# EAGLE design Matrix (EAGLE 5.06)
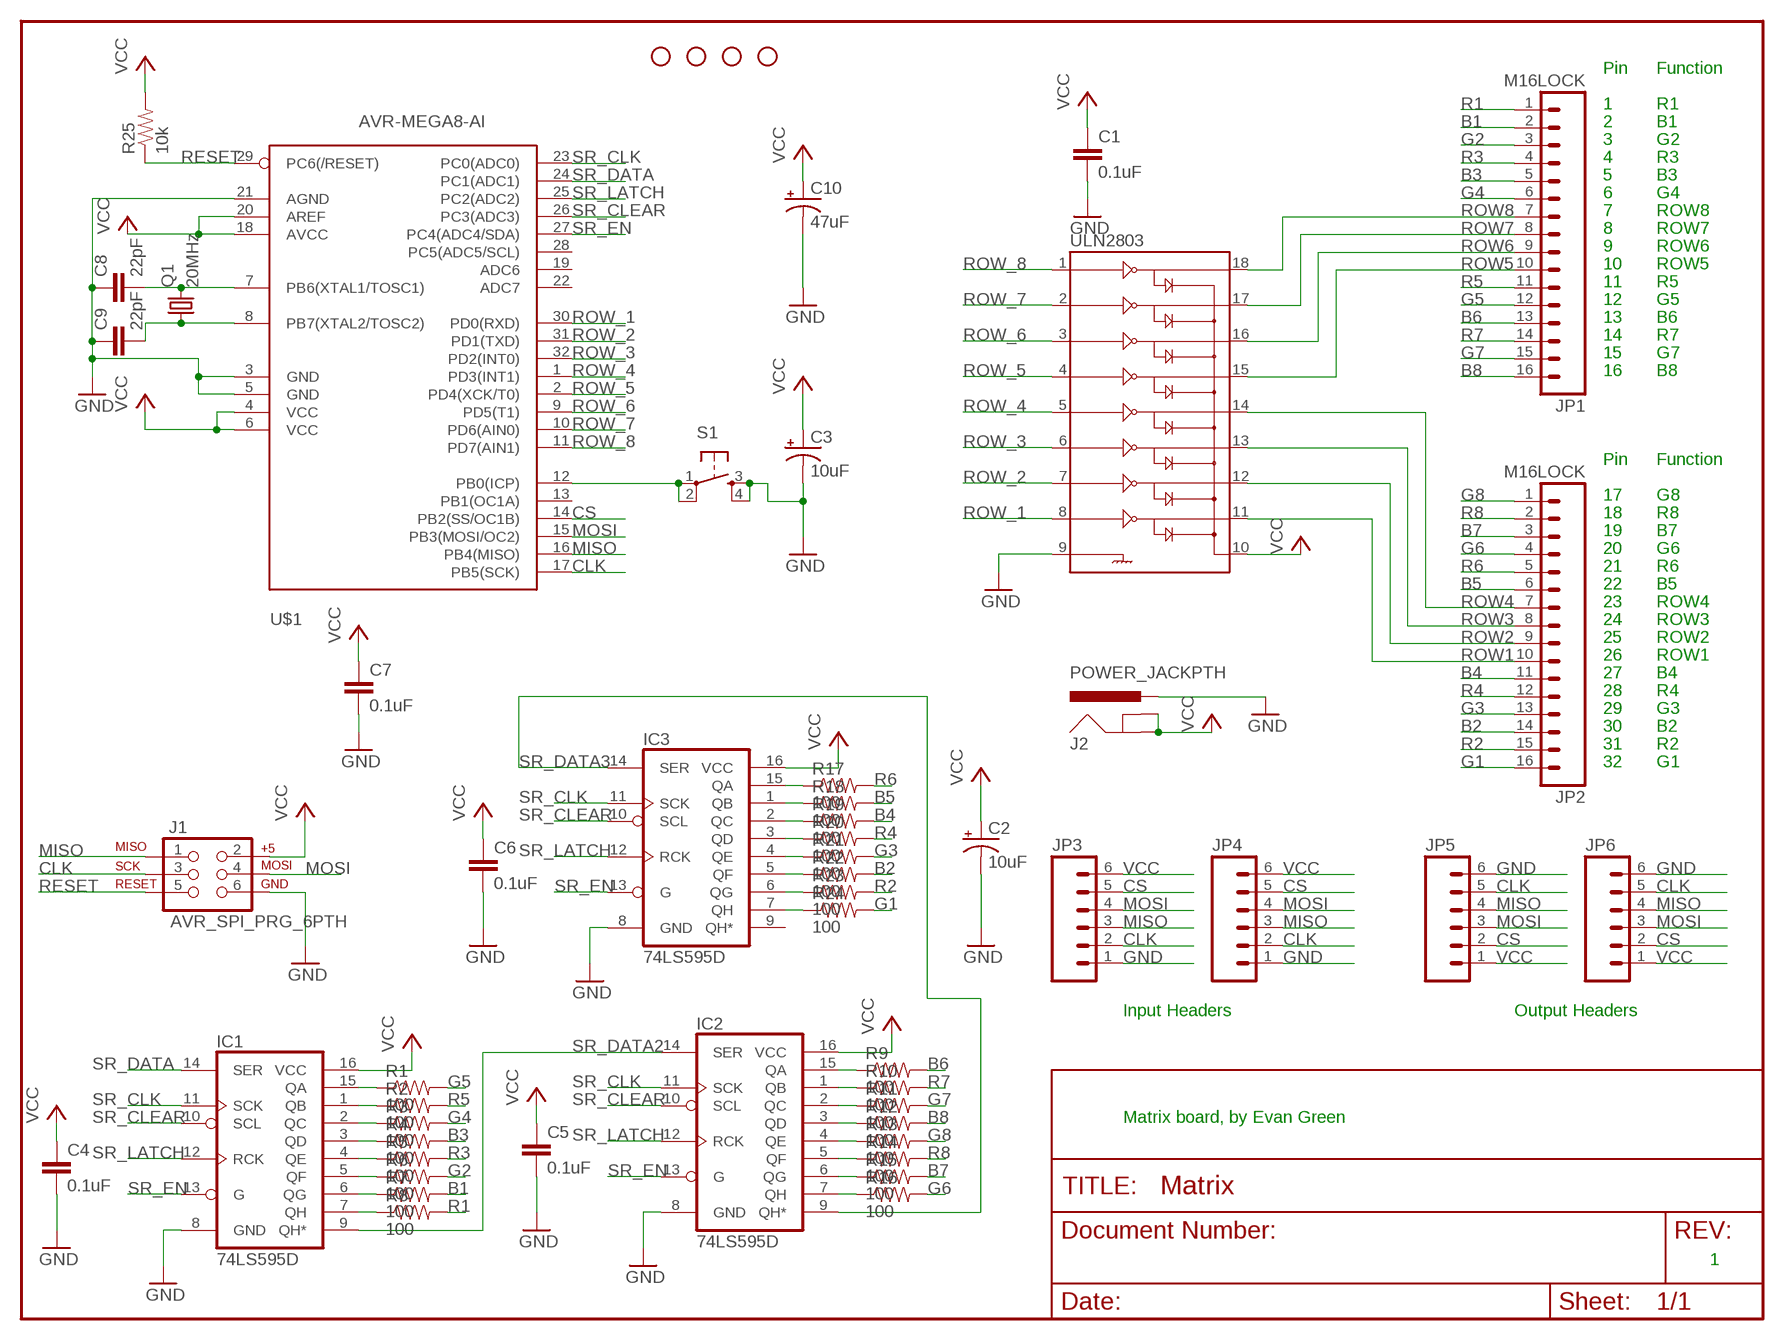
[diagram p0: schematic, sheet 1]

## Parts
C1  0.1uF  CAP0402-CAP  [0402-CAP]
C2  10uF  CAP_POLPTH2  [CPOL-RADIAL-10UF-25V]
C3  10uF  CAP_POLPTH2  [CPOL-RADIAL-10UF-25V]
C4  0.1uF  CAP0402-CAP  [0402-CAP]
C5  0.1uF  CAP0402-CAP  [0402-CAP]
C6  0.1uF  CAP0402-CAP  [0402-CAP]
C7  0.1uF  CAP0402-CAP  [0402-CAP]
C8  22pF  CAP0402-CAP  [0402-CAP]
C9  22pF  CAP0402-CAP  [0402-CAP]
C10  47uF  CAP_POLPTH2  [CPOL-RADIAL-10UF-25V]
IC1  74LS595D  [SO16]
IC2  74LS595D  [SO16]
IC3  74LS595D  [SO16]
J1  AVR_SPI_PRG_6PTH  [2X3]
J2  POWER_JACKPTH  [POWER_JACK_PTH]
JP1  M16LOCK  [1X16_LOCK]
JP2  M16LOCK  [1X16_LOCK]
JP3  M06SIP  [1X06]
JP4  M06SIP  [1X06]
JP5  M06SIP  [1X06]
JP6  M06SIP  [1X06]
JP7  STAND-OFF  [STAND-OFF]
JP8  STAND-OFF  [STAND-OFF]
JP9  STAND-OFF  [STAND-OFF]
JP10  STAND-OFF  [STAND-OFF]
Q1  20MHz  CRYSTALHC49US  [HC49US]
R1  100  RESISTOR0402-RES  [0402-RES]
R2  100  RESISTOR0402-RES  [0402-RES]
R3  100  RESISTOR0402-RES  [0402-RES]
R4  100  RESISTOR0402-RES  [0402-RES]
R5  100  RESISTOR0402-RES  [0402-RES]
R6  100  RESISTOR0402-RES  [0402-RES]
R7  100  RESISTOR0402-RES  [0402-RES]
R8  100  RESISTOR0402-RES  [0402-RES]
R9  100  RESISTOR0402-RES  [0402-RES]
R10  100  RESISTOR0402-RES  [0402-RES]
R11  100  RESISTOR0402-RES  [0402-RES]
R12  100  RESISTOR0402-RES  [0402-RES]
R13  100  RESISTOR0402-RES  [0402-RES]
R14  100  RESISTOR0402-RES  [0402-RES]
R15  100  RESISTOR0402-RES  [0402-RES]
R16  100  RESISTOR0402-RES  [0402-RES]
R17  100  RESISTOR0402-RES  [0402-RES]
R18  100  RESISTOR0402-RES  [0402-RES]
R19  100  RESISTOR0402-RES  [0402-RES]
R20  100  RESISTOR0402-RES  [0402-RES]
R21  100  RESISTOR0402-RES  [0402-RES]
R22  100  RESISTOR0402-RES  [0402-RES]
R23  100  RESISTOR0402-RES  [0402-RES]
R24  100  RESISTOR0402-RES  [0402-RES]
R25  10k  RESISTOR0402-RES  [0402-RES]
S1  TAC_SWITCHSMD  [TACTILE_SWITCH_SMD]
U$1  AVR-MEGA8-AI  [TQFP32-08]
ULN2803  ULN2803SOICW  [SO18L]

## Nets
B1: JP1.2 R7.2
B2: JP2.14 R22.2
B3: JP1.5 R4.2
B4: JP2.11 R19.2
B5: JP2.6 R18.2
B6: JP1.13 R9.2
B7: JP2.3 R15.2
B8: JP1.16 R12.2
CLK: J1.3 JP3.2 JP4.2 JP5.5 JP6.5 U$1.17(PB5(SCK))
CS: JP3.5 JP4.5 JP5.2 JP6.2 U$1.14(PB2(SS/OC1B))
G1: JP2.16 R24.2
G2: JP1.3 R6.2
G3: JP2.13 R21.2
G4: JP1.6 R3.2
G5: JP1.12 R1.2
G6: JP2.4 R16.2
G7: JP1.15 R11.2
G8: JP2.1 R13.2
GND: C1.2 C2.2(-) C3.2(-) C4.2 C5.2 C6.2 C7.2 C8.1 C9.1 C10.2(-) IC1.8(GND) IC2.8(GND) IC3.8(GND) J1.6 J2.PWR JP3.1 JP4.1 JP5.6 JP6.6 S1.3 S1.4 U$1.3(GND) U$1.5(GND) U$1.21(AGND) ULN2803.9
MISO: J1.1 JP3.3 JP4.3 JP5.4 JP6.4 U$1.16(PB4(MISO))
MOSI: J1.4 JP3.4 JP4.4 JP5.3 JP6.3 U$1.15(PB3(MOSI/OC2))
N$1: IC1.15(QA) R1.1
N$2: IC1.1(QB) R2.1
N$3: IC1.2(QC) R3.1
N$4: IC1.3(QD) R4.1
N$5: IC1.4(QE) R5.1
N$6: IC1.5(QF) R6.1
N$7: IC1.6(QG) R7.1
N$8: IC1.7(QH) R8.1
N$9: IC2.15(QA) R9.1
N$10: IC2.1(QB) R10.1
N$11: IC2.2(QC) R11.1
N$12: IC2.3(QD) R12.1
N$13: IC2.4(QE) R13.1
N$14: IC2.5(QF) R14.1
N$15: IC2.6(QG) R15.1
N$16: IC2.7(QH) R16.1
N$17: IC3.15(QA) R17.1
N$18: IC3.1(QB) R18.1
N$19: IC3.2(QC) R19.1
N$20: IC3.3(QD) R20.1
N$21: IC3.4(QE) R21.1
N$22: IC3.5(QF) R22.1
N$23: IC3.6(QG) R23.1
N$24: IC3.7(QH) R24.1
N$25: C8.2 Q1.2 U$1.7(PB6(XTAL1/TOSC1))
N$26: C9.2 Q1.1 U$1.8(PB7(XTAL2/TOSC2))
N$27: S1.1 S1.2 U$1.12(PB0(ICP))
R1: JP1.1 R8.2
R2: JP2.15 R23.2
R3: JP1.4 R5.2
R4: JP2.12 R20.2
R5: JP1.11 R2.2
R6: JP2.5 R17.2
R7: JP1.14 R10.2
R8: JP2.2 R14.2
RESET: J1.5 R25.1 U$1.29(PC6(/RESET))
ROW1: JP2.10 ULN2803.11
ROW2: JP2.9 ULN2803.12
ROW3: JP2.8 ULN2803.13
ROW4: JP2.7 ULN2803.14
ROW5: JP1.10 ULN2803.15
ROW6: JP1.9 ULN2803.16
ROW7: JP1.8 ULN2803.17
ROW8: JP1.7 ULN2803.18
ROW_1: U$1.30(PD0(RXD)) ULN2803.8
ROW_2: U$1.31(PD1(TXD)) ULN2803.7
ROW_3: U$1.32(PD2(INT0)) ULN2803.6
ROW_4: U$1.1(PD3(INT1)) ULN2803.5
ROW_5: U$1.2(PD4(XCK/T0)) ULN2803.4
ROW_6: U$1.9(PD5(T1)) ULN2803.3
ROW_7: U$1.10(PD6(AIN0)) ULN2803.2
ROW_8: U$1.11(PD7(AIN1)) ULN2803.1
SR_CLEAR: IC1.10(SCL) IC2.10(SCL) IC3.10(SCL) U$1.26(PC3(ADC3))
SR_CLK: IC1.11(SCK) IC2.11(SCK) IC3.11(SCK) U$1.23(PC0(ADC0))
SR_DATA: IC1.14(SER) U$1.24(PC1(ADC1))
SR_DATA2: IC1.9(QH*) IC2.14(SER)
SR_DATA3: IC2.9(QH*) IC3.14(SER)
SR_EN: IC1.13(G) IC2.13(G) IC3.13(G) U$1.27(PC4(ADC4/SDA))
SR_LATCH: IC1.12(RCK) IC2.12(RCK) IC3.12(RCK) U$1.25(PC2(ADC2))
VCC: C1.1 C2.1(+) C3.1(+) C4.1 C5.1 C6.1 C7.1 C10.1(+) IC1.16(VCC) IC2.16(VCC) IC3.16(VCC) J1.2 J2.GND J2.GNDBREAK JP3.6 JP4.6 JP5.1 JP6.1 R25.2 U$1.4(VCC) U$1.6(VCC) U$1.18(AVCC) U$1.20(AREF) ULN2803.10
Unconnected: IC3.9(QH*) U$1.13(PB1(OC1A)) U$1.19(ADC6) U$1.22(ADC7) U$1.28(PC5(ADC5/SCL))

## Notes on the sheet
- Pin | Function
- 1 | R1
- 2 | B1
- 3 | G2
- 4 | R3
- 5 | B3
- 6 | G4
- 7 | ROW8
- 8 | ROW7
- 9 | ROW6
- 10 | ROW5
- 11 | R5
- 12 | G5
- 13 | B6
- 14 | R7
- 15 | G7
- 16 | B8
- Pin | Function
- 17 | G8
- 18 | R8
- 19 | B7
- 20 | G6
- 21 | R6
- 22 | B5
- 23 | ROW4
- 24 | ROW3
- 25 | ROW2
- 26 | ROW1
- 27 | B4
- 28 | R4
- 29 | G3
- 30 | B2
- 31 | R2
- 32 | G1
- Input Headers | Output Headers
- Matrix board, by Evan Green
- 1

## Library data of the parts
C1 C4-C9 = SparkFun:CAP: Capacitor Standard 0603 ceramic capacitor, and 0.1" leaded capacitor.
C2 C3 C10 = SparkFun:CAP_POL: Capacitor Polarized These are standard SMD and PTH capacitors. Normally 10uF, 47uF, and 100uF in electrolytic and tantalum varieties. Always verify the external diameter of the through hole cap, it varies with capacity, voltage, and manufacturer. The EIA devices should be standard.
IC1-IC3 = SparkFun:74*595: 8-bit SHIFT REGISTER, output latch
J1 = SparkFun:AVR_SPI_PRG_6: AVR ISP 6 Pin This is the reduced ISP connector for AVR programming. Common on Arduino. This footprint will take up less PCB space and can be used with a 10-pin to 6-pin adapter such as SKU: BOB-08508
J2 = SparkFun:POWER_JACK: Power Jack This is the standard 5.5mm barrel jack for power. The PTH is the most common, proven, reliable, footprint. All others are experimental. The Slot footprint only works if the mill layer is transmitted to the PCB fab house so be warned. Spark Fun Electronics SKU : PRT-00119. Mating wall wart : TOL-00298 (and others)
JP1 JP2 = SparkFun:M16
JP3-JP6 = SparkFun:M06: Header 6 Standard 6-pin 0.1" header. Use with straight break away headers (SKU : PRT-00116), right angle break away headers (PRT-00553), swiss pins (PRT-00743), machine pins (PRT-00117), and female headers (PRT-00115). Molex polarized connector foot print use with SKU : PRT-08094 with associated crimp pins and housings. NOTES ON THE VARIANTS LOCK and LOCK_LONGPADS... This footprint was designed to help hold the alignment of a through-hole component (i.e. 6-pin header) while soldering it into place. You may notice that each hole has been shifted either up or down by 0.005 of an inch from it's more standard position (which is a perfectly straight line). This slight alteration caused the pins (the squares in the middle) to touch the edges of the holes. Because they are alternating, it causes a "brace" to hold the component in place. 0.005 has proven to be the perfect amount of "off-center" position when using our standard breakaway headers. Although looks a little odd when you look at the bare footprint, once you have a header in there, the alteration is very hard to notice. Also, if you push a header all the way into place, it is covered up entirely on the bottom side. This idea of altering the position of holes to aid alignment will be further integrated into the Sparkfun Library for other footprints. It can help hold any component with 3 or more connection pins.
JP7-JP10 = SparkFun:STAND-OFF: Stand Off This is the mechanical footprint for a #4 phillips button head screw. Use the keepout ring to avoid running the screw head into surrounding components. SKU : PRT-00447
Q1 = SparkFun:CRYSTAL: Crystals Various standard crystals. Proven footprints. Spark Fun Electronics SKU : COM-00534
R1-R25 = SparkFun:RESISTOR: Resistor Basic schematic elements and footprints for 0603, 1206, and PTH 1/10th watt (small) resistors.
S1 = SparkFun:TAC_SWITCH: Momentary Switch Button commonly used for reset or general input. Spark Fun Electronics SKU : COM-00097
U$1 = SparkFun:AVR-MEGA8: MICROCONTROLLER 8 Kbytes FLASH 1 kbytes SRAM 512 bytes EEPROM USART 6-channel 10 bit ADC 2-channel 8 bit ADC
ULN2803 = SparkFun:ULN2803: Darlington Driver ULN2803 Darlington array. 500mA max per channel, 8-channel package. Spark Fun Electronics SKU : COM-00312

## Board
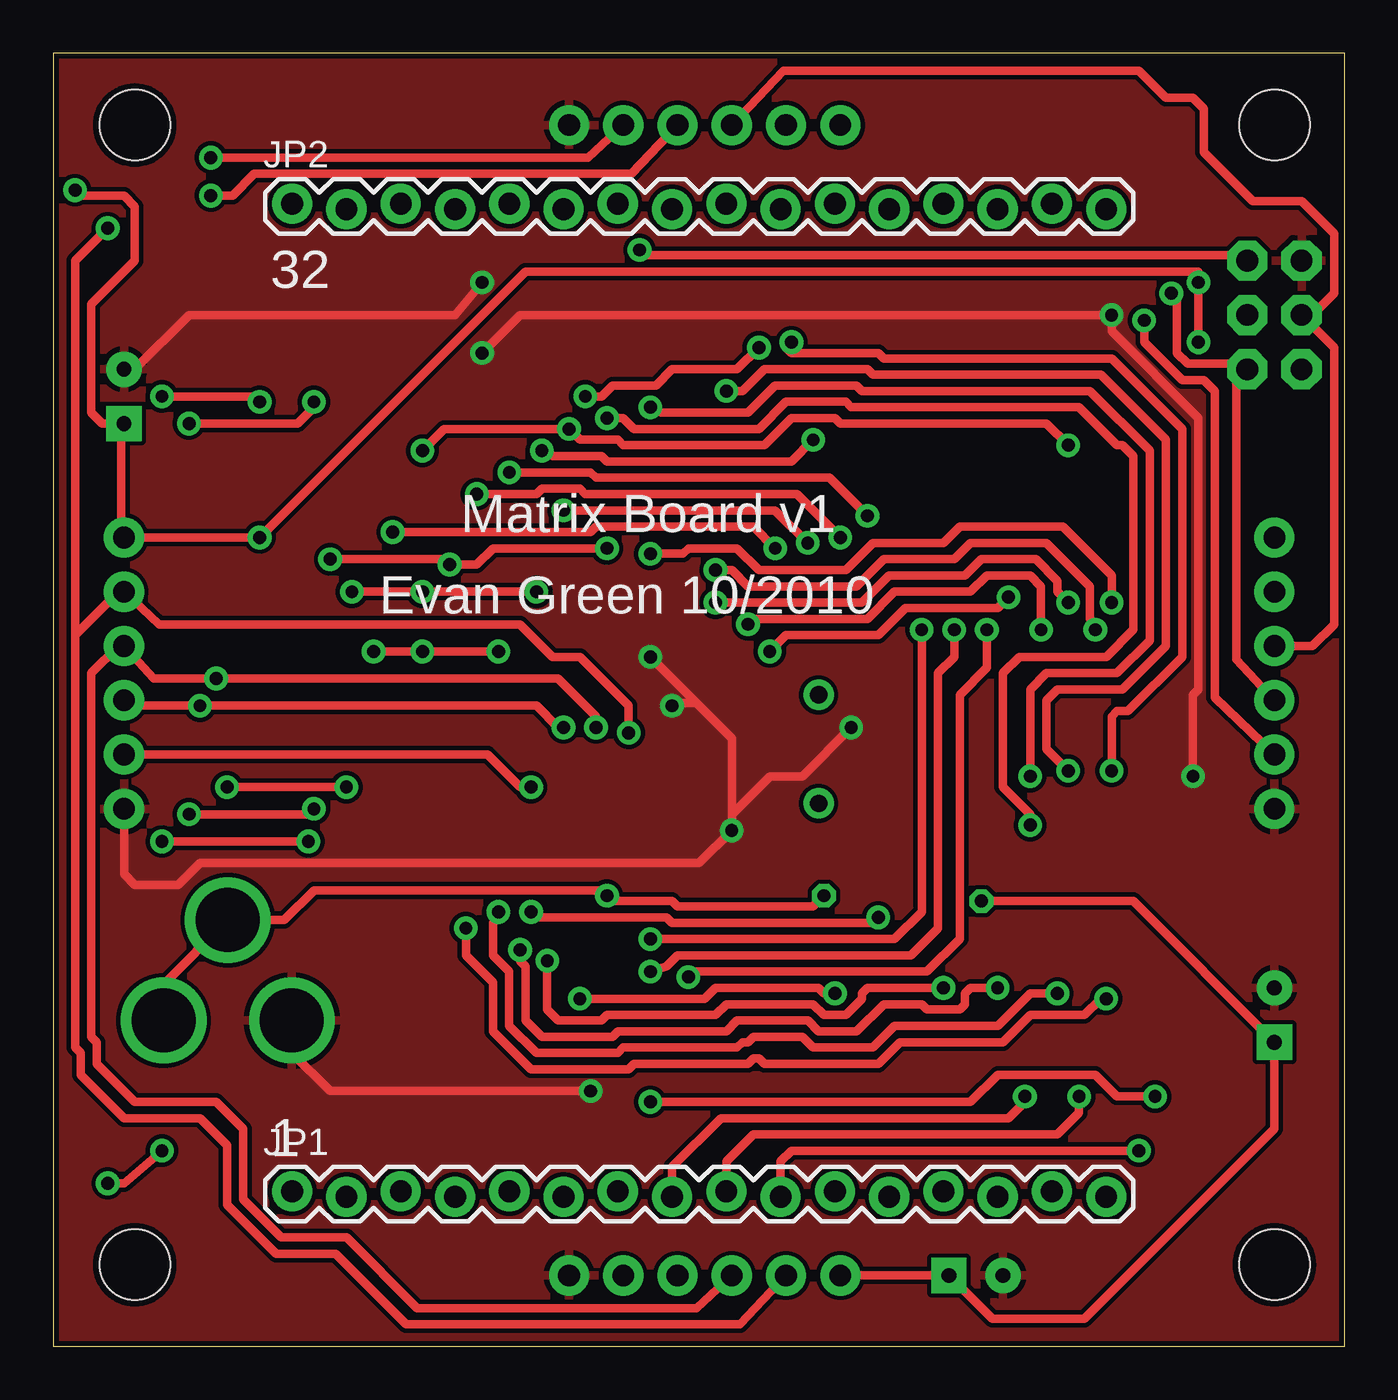
[diagram p1: board, top side]
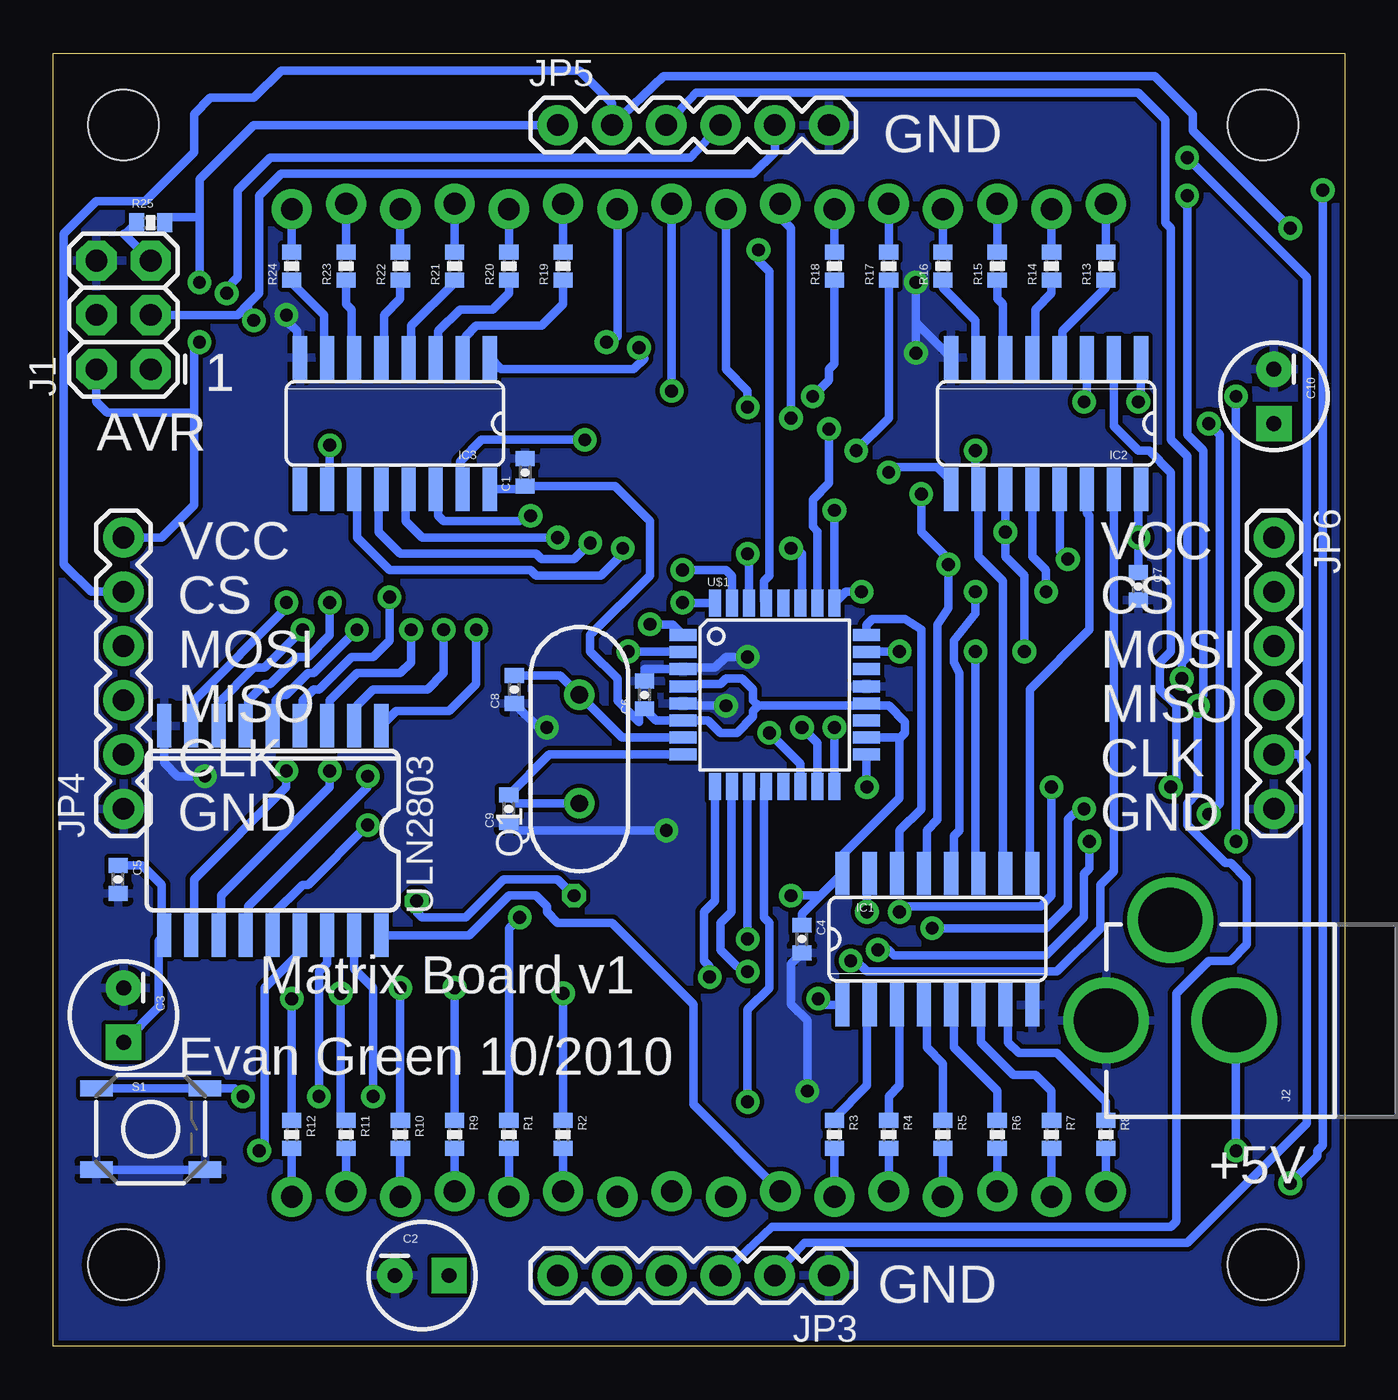
[diagram p2: board, bottom side, seen from below]

Size 60.43 x 60.5 mm. Coordinates in mm from the lower left corner, seen from the top.
Outline: 0,0 60.43,0 60.43,60.5 0,60.5 0,0
Copper layers (1*16): Top 0.035mm / dielectric 1.5mm / Bottom 0.035mm
Design rules "SparkFun": minimum track width 8mil, minimum drill 20mil, track to track 8mil, track to pad 8mil, pad to pad 8mil, via to via 8mil, smd to smd 8mil, copper to edge 10mil, drill to drill 8mil, minimum pad ring 12mil, minimum via ring 10mil, stop-mask expansion 4mil, vias tented up to drill 25mil, thermal gap 10mil

### Footprints (pad centres in the part's own frame; a part is rotated, then mirrored left to right if it is on the bottom)
0402-CAP = smd 0.7 x 0.9: 1 -0.65,0; 2 0.65,0
CPOL-RADIAL-10UF-25V = drill 0.7 pad 1.651 square: 1 1.27,0 | drill 0.7 pad 1.651 round: 2 -1.27,0
SO16 = smd 0.66 x 2.032: 1 -4.445,-3.073; 2 -3.175,-3.073; 3 -1.905,-3.073; 4 -0.635,-3.073; 5 0.635,-3.073; 6 1.905,-3.073; 7 3.175,-3.073; 8 4.445,-3.073; 9 4.445,3.073; 10 3.175,3.073; 11 1.905,3.073; 12 0.635,3.073; 13 -0.635,3.073; 14 -1.905,3.073; 15 -3.175,3.073; 16 -4.445,3.073
2X3 = drill 1.016 pad 1.88 octagon: 1 0,0; 2 0,2.54; 3 2.54,0; 4 2.54,2.54; 5 5.08,0; 6 5.08,2.54
POWER_JACK_PTH = drill 2.997 round: GND 0,7.7; GNDBREAK 4.7,10.7; PWR 0,13.7
1X16_LOCK = drill 1.016 pad 1.88 round: 1 0,0.127; 2 2.54,-0.127; 3 5.08,0.127; 4 7.62,-0.127; 5 10.16,0.127; 6 12.7,-0.127; 7 15.24,0.127; 8 17.78,-0.127; 9 20.32,0.127; 10 22.86,-0.127; 11 25.4,0.127; 12 27.94,-0.127; 13 30.48,0.127; 14 33.02,-0.127; 15 35.56,0.127; 16 38.1,-0.127
1X06 = drill 1.016 pad 1.88 round: 1 0,0; 2 2.54,0; 3 5.08,0; 4 7.62,0; 5 10.16,0; 6 12.7,0
STAND-OFF = hole 3.302: 0,0
HC49US = drill 0.813 round: 1 -2.54,0; 2 2.54,0
0402-RES = smd 0.7 x 0.9: 1 -0.65,0; 2 0.65,0
TACTILE_SWITCH_SMD = smd 1.524 x 0.762: 1 -2.54,1.905; 2 2.54,1.905; 3 -2.54,-1.905; 4 2.54,-1.905
TQFP32-08 = smd 1.27 x 0.559: 1 -4.293,2.8; 2 -4.293,2; 3 -4.293,1.2; 4 -4.293,0.4; 5 -4.293,-0.4; 6 -4.293,-1.2; 7 -4.293,-2; 8 -4.293,-2.8; 17 4.293,-2.8; 18 4.293,-2; 19 4.293,-1.2; 20 4.293,-0.4; 21 4.293,0.4; 22 4.293,1.2; 23 4.293,2; 24 4.293,2.8 | smd 0.559 x 1.27: 9 -2.8,-4.293; 10 -2,-4.293; 11 -1.2,-4.293; 12 -0.4,-4.293; 13 0.4,-4.293; 14 1.2,-4.293; 15 2,-4.293; 16 2.8,-4.293; 25 2.8,4.293; 26 2,4.293; 27 1.2,4.293; 28 0.4,4.293; 29 -0.4,4.293; 30 -1.2,4.293; 31 -2,4.293; 32 -2.8,4.293
SO18L = smd 0.66 x 2.032: 1 -0.635,-4.902; 2 0.635,-4.902; 3 1.905,-4.902; 4 3.175,-4.902; 5 4.445,-4.902; 6 5.715,-4.902; 7 6.985,-4.902; 8 8.255,-4.902; 9 9.525,-4.902; 10 9.525,4.902; 11 8.255,4.902; 12 6.985,4.902; 13 5.715,4.902; 14 4.445,4.902; 15 3.175,4.902; 16 1.905,4.902; 17 0.635,4.902; 18 -0.635,4.902

### Placement (x,y rotation side)
C1  38.35,40.89 90 bottom
C2  43.18,3.3 0 bottom
C3  57.15,15.49 270 bottom
C4  25.4,19.05 270 bottom
C5  57.4,21.84 270 bottom
C6  32.77,30.48 90 bottom
C7  9.65,35.56 270 bottom
C8  38.86,30.73 90 bottom
C9  39.12,25.15 90 bottom
C10  3.3,44.45 270 bottom
IC1  19.05,19.05 0 bottom
IC2  13.97,43.18 180 bottom
IC3  44.45,43.18 180 bottom
J1  55.88,45.72 90 bottom
J2  -2.54,15.24 90 bottom
JP1  11.18,7.11 0 top
JP2  11.18,53.34 0 top
JP3  24.13,3.3 180 bottom
JP4  57.15,25.15 90 bottom
JP5  36.83,57.15 0 bottom
JP6  3.3,37.85 270 bottom
JP7  3.81,3.81 0 top
JP8  3.81,57.15 0 top
JP9  57.15,57.15 0 top
JP10  57.15,3.81 0 top
Q1  35.81,27.94 90 bottom
R1  39.12,9.91 270 bottom
R2  36.58,9.91 270 bottom
R3  23.88,9.91 270 bottom
R4  21.34,9.91 270 bottom
R5  18.8,9.91 270 bottom
R6  16.26,9.91 270 bottom
R7  13.72,9.91 270 bottom
R8  11.18,9.91 270 bottom
R9  41.66,9.91 270 bottom
R10  44.2,9.91 270 bottom
R11  46.74,9.91 270 bottom
R12  49.28,9.91 270 bottom
R13  11.18,50.55 90 bottom
R14  13.72,50.55 90 bottom
R15  16.26,50.55 90 bottom
R16  18.8,50.55 90 bottom
R17  21.34,50.55 90 bottom
R18  23.88,50.55 90 bottom
R19  36.58,50.55 90 bottom
R20  39.12,50.55 90 bottom
R21  41.66,50.55 90 bottom
R22  44.2,50.55 90 bottom
R23  46.74,50.55 90 bottom
R24  49.28,50.55 90 bottom
R25  55.88,52.58 0 bottom
S1  55.88,10.16 0 bottom
U$1  26.67,30.48 0 bottom
ULN2803  45.72,24.13 180 bottom

### Tracks (layer width: path | path; a pad name or v marks a point on that pad's centre or on a via)
B1
  Bottom 0.406: JP1.2 R7.2
B2
  Bottom 0.406: R22.2 JP2.14
B3
  Bottom 0.406: JP1.5 R4.2
B4
  Bottom 0.406: R19.2 JP2.11
B5
  Bottom 0.406: R18.2 JP2.6
B6
  Bottom 0.406: JP1.13 R9.2
B7
  Bottom 0.406: R15.2 JP2.3
B8
  Bottom 0.406: JP1.16 R12.2
CLK  (via drill 0.6)
  Top 0.406: JP6.5 20.32,27.69 21.84,26.16 v22.35,26.16 | JP5.5 25.02,55.63 v7.37,55.63 | JP4.2 54.36,30.35 54.36,44.7 53.85,45.21 52.83,45.21 51.05,46.99 v51.05,48.01
  Bottom 0.406: v22.35,26.16 22.38,26.19 U$1.17 | JP3.2 25.27,4.83 7.37,4.83 1.78,10.41 1.78,27.18 2.03,27.43 2.03,27.69 | 3.17,27.3 JP6.5 2.03,27.69 | v7.37,55.63 1.78,50.04 1.78,27.94 2.03,27.69 | JP5.5 26.67,55.88 27.69,54.86 49.78,54.86 50.8,53.85 50.8,49.28 51.31,48.77 | 51.31,48.77 51.82,48.26 J1.3 | v51.05,48.01 51.31,48.26 51.31,48.77
CS  (via drill 0.6)
  Top 0.406: v26.92,28.7 26.92,29.97 24.64,32.26 23.37,32.26 21.84,33.78 4.95,33.78 JP6.2 3.05,35.31 1.02,33.27 | JP3.5 32.13,1.02 16.51,1.02 13.21,4.32 10.41,4.32 8.13,6.6 8.13,9.4 6.86,10.67 3.3,10.67 1.27,12.7 1.27,13.72 1.02,13.97 1.02,33.27 | v2.54,52.32 1.02,50.8 1.02,33.27
  Bottom 0.406: v26.92,28.7 25.47,27.25 U$1.14 | v2.54,52.32 7.11,56.9 7.11,57.66 8.89,59.44 31.88,59.44 JP5.2 34.29,58.17 35.81,59.69 49.78,59.69 51.05,58.42 53.09,58.42 53.85,57.66 53.85,55.88 56.13,53.59 58.42,53.59 59.94,52.07 59.94,36.58 58.67,35.31 JP4.5
G1
  Bottom 0.406: R24.2 JP2.16
G2
  Bottom 0.406: JP1.3 R6.2
G3
  Bottom 0.406: R21.2 JP2.13
G4
  Bottom 0.406: JP1.6 R3.2
G5
  Bottom 0.406: JP1.12 R1.2
G6
  Bottom 0.406: R16.2 JP2.4
G7
  Bottom 0.406: JP1.15 R11.2
G8
  Bottom 0.406: R13.2 JP2.1
GND  (via drill 0.6)
  Top 0.406: v20.07,49.78 18.8,48.26 6.35,48.26 3.81,45.72 C10.2 | v25.15,11.94 12.95,11.94 11.16,13.73 J2.PWR | v31.75,24.13 30.23,22.61 6.86,22.61 5.84,21.59 3.81,21.59 3.3,22.1 JP6.6 | v37.34,28.96 35.05,26.67 33.53,26.67 31.75,24.89 v31.75,24.13 | 30.1,30.1 31.75,28.45 v31.75,24.13 | 30.1,30.1 v27.94,32.26 | v28.96,29.97 28.83,30.1 30.1,30.1 | v20.07,46.48 21.84,48.26 v49.53,48.26 49.53,47.5 53.59,43.43 53.59,30.73 53.34,30.48 v53.34,26.67
  Bottom 0.406: IC2.8 20.07,47.9 v20.07,49.78 v20.07,46.48 | C4.2 25.91,17.89 25.91,16 25.15,15.24 v25.15,11.94 | C9.1 38.75,24.13 v31.75,24.13 | C8.1 37.73,28.96 v37.34,28.96 | v27.94,32.26 28.96,32.26 29.46,31.75 30.89,31.75 U$1.3 32.77,31.68 C6.2 | U$1.5 30.86,29.97 v28.96,29.97 | IC3.8 49.02,46.38 49.02,47.5 49.53,48.01 v49.53,48.26 | v53.34,26.67 54.61,26.67 55.24,27.3 ULN2803.9 | S1.4 S1.3
  pour Top: 0,0 60.45,0 60.45,60.45 0,60.45
  pour Bottom: 0,60.45 0,0 60.45,0 60.45,60.45
MISO  (via drill 0.6)
  Top 0.406: JP6.4 3.68,29.97 v6.86,29.97 22.61,29.97 23.62,28.96 v23.88,28.96 | JP5.4 27.05,54.86 9.4,54.86 8.38,53.85 v7.37,53.85 | 55.37,45.72 J1.1 | JP4.3 55.37,32.13 55.37,45.72 | 55.37,45.72 55.12,45.97 53.09,45.97 52.58,46.48 52.58,49.02 v52.32,49.28
  Bottom 0.406: v23.88,28.96 v23.87,28.95 U$1.16 | JP3.3 26.8,5.59 8.13,5.59 7.87,5.84 7.87,16.51 6.35,18.03 5.33,18.03 4.57,18.8 4.57,21.84 5.33,22.61 5.59,22.61 7.37,24.38 7.37,25.4 6.86,25.91 v6.86,29.97 6.86,30.23 6.6,30.48 6.6,41.91 7.37,42.67 7.37,53.34 7.62,53.59 v7.37,53.85 | JP5.4 30.61,55.63 50.29,55.63 51.82,54.1 51.82,50.04 52.07,49.78 v52.32,49.28
MOSI  (via drill 0.6)
  Top 0.406: v25.4,28.96 25.4,29.46 23.62,31.24 v7.62,31.24 4.7,31.24 JP6.3 3.05,32.77 1.78,31.5 1.78,14.48 2.03,14.22 2.03,13.21 3.81,11.43 7.62,11.43 8.89,10.16 8.89,6.86 10.67,5.08 13.72,5.08 17.02,1.78 30.1,1.78 JP3.4 | JP5.3 34.16,59.69 50.8,59.69 52.07,58.42 53.34,58.42 53.85,57.91 53.85,55.88 56.13,53.59 58.42,53.59 59.94,52.07 59.94,49.28 58.93,48.26 J1.4 59.94,46.74 59.94,33.78 58.93,32.77 JP4.4
  Bottom 0.406: v25.4,28.96 24.67,28.23 U$1.15 | JP5.3 30.35,58.67 9.65,58.67 8.38,57.4 8.38,52.58 8.13,52.32 8.13,42.42 7.37,41.66 7.37,32.26 7.62,32 v7.62,31.24
N$1  (via drill 0.6)
  Top 0.406: v22.35,20.32 22.61,20.07 28.7,20.07 28.96,19.81 38.35,19.81 v38.61,20.07
  Bottom 0.406: IC1.15 22.35,22 v22.35,20.32 | v38.61,20.07 39.12,19.56 R1.1
N$2  (via drill 0.6)
  Top 0.406: v24.64,16.26 30.48,16.26 30.99,16.76 35.81,16.76 36.07,16.51 v36.58,16.51
  Bottom 0.406: v36.58,16.51 R2.1 | v24.64,16.26 24.36,15.98 IC1.1
N$3
  Bottom 0.406: IC1.2 22.35,15.85 22.35,12.19 23.88,10.67 R3.1
N$4
  Bottom 0.406: IC1.3 20.83,15.85 20.83,12.19 21.34,11.68 R4.1
N$5
  Bottom 0.406: IC1.4 19.56,15.85 19.56,13.97 18.8,13.21 R5.1
N$6
  Bottom 0.406: IC1.5 18.29,15.85 18.29,13.97 16.26,11.94 R6.1
N$7
  Bottom 0.406: IC1.6 17.02,15.85 17.02,14.22 15.49,12.7 14.48,12.7 13.72,11.94 R7.1
N$8
  Bottom 0.406: IC1.7 15.75,15.85 15.75,14.22 15.24,13.72 13.46,13.72 11.18,11.43 R8.1
N$9  (via drill 0.6)
  Top 0.406: v41.66,16.76 38.1,16.76 37.85,16.51 37.85,16.26 37.08,15.49 36.07,15.49 35.56,16 31.5,16 30.99,15.49 25.91,15.49 25.65,15.24 23.62,15.24 23.11,15.75 v23.11,18.03
  Bottom 0.406: v41.66,16.76 R9.1 | IC2.15 10.79,22.23 11.43,21.59 11.43,19.56 13.46,17.53 22.35,17.53 22.86,18.03 v23.11,18.03
N$10  (via drill 0.6)
  Top 0.406: v44.2,16.76 42.93,16.76 42.67,16.51 42.67,16 42.42,15.75 40.89,15.75 40.64,16 38.86,16 37.59,14.73 35.81,14.73 35.31,15.24 32,15.24 31.5,14.73 26.42,14.73 26.16,14.48 22.86,14.48 22.1,15.24 22.1,17.78 21.84,18.03 v21.84,18.54 | v5.08,23.62 v11.94,23.62 | v5.08,44.45 9.4,44.45 v9.65,44.2
  Bottom 0.406: v44.2,16.76 R10.1 | v11.94,23.62 11.94,22.35 12.19,22.1 12.19,20.07 13.97,18.29 21.08,18.29 21.34,18.54 v21.84,18.54 | v5.08,23.62 v5.08,44.45 | v9.65,44.2 9.53,44.32 IC2.1
N$11  (via drill 0.6)
  Top 0.406: v46.99,16.51 45.72,16.51 44.2,14.99 39.37,14.99 38.35,13.97 35.56,13.97 35.05,14.48 32.77,14.48 32.51,14.22 32.26,14.22 32,13.97 26.67,13.97 26.42,13.72 22.61,13.72 21.34,14.99 21.34,17.53 20.57,18.29 20.57,19.81 20.83,20.07 v20.83,20.32 | v8.13,26.16 v13.72,26.16
  Bottom 0.406: R11.1 46.99,10.81 v46.99,16.51 | v20.83,20.32 20.57,20.57 14.22,20.57 13.72,21.08 v13.72,26.16 | IC2.2 10.79,43.05 9.65,41.91 9.14,41.91 8.13,40.89 8.13,32.51 8.64,32 8.64,30.73 7.87,29.97 7.87,26.42 v8.13,26.16
N$12  (via drill 0.6)
  Top 0.406: v19.3,19.56 19.3,18.29 20.57,17.02 20.57,14.73 22.35,12.95 26.92,12.95 27.18,13.21 32.51,13.21 32.77,13.46 33.02,13.46 33.27,13.21 38.61,13.21 39.62,14.22 44.45,14.22 45.72,15.49 48.26,15.49 49.02,16.26 v49.28,16.26 | v12.19,25.15 11.94,24.89 v6.35,24.89 | v6.35,43.18 11.43,43.18 12.19,43.94 v12.19,44.2
  Bottom 0.406: v49.28,16.26 R12.1 | v19.3,19.56 13.97,19.56 12.95,20.57 12.95,24.64 12.45,25.15 v12.19,25.15 | v6.35,24.89 5.84,25.4 5.84,42.67 v6.35,43.18 | v12.19,44.2 12.06,44.32 IC2.3
N$13
  Bottom 0.406: IC2.4 13.21,46.38 13.21,47.5 11.18,49.53 R13.1
N$14
  Bottom 0.406: IC2.5 14.48,46.38 14.48,48.51 13.72,49.28 R14.1
N$15
  Bottom 0.406: IC2.6 16,46.38 16,48.77 16.26,49.02 R15.1
N$16
  Bottom 0.406: IC2.7 17.27,46.38 17.27,48.01 18.8,49.53 R16.1
N$17  (via drill 0.6)
  Top 0.406: v35.56,42.42 34.54,41.4 25.91,41.4 25.65,41.66 23.37,41.66 23.11,41.91 v22.86,41.91
  Bottom 0.406: IC3.15 41.4,40.23 41.4,41.4 40.39,42.42 v35.56,42.42 | v22.86,41.91 21.34,43.43 R17.1
N$18  (via drill 0.6)
  Top 0.406: v33.02,46.74 32,45.72 28.96,45.72 28.19,44.96 26.16,44.96 25.65,44.45 v24.89,44.45
  Bottom 0.406: IC3.1 39.47,45.72 33.27,45.72 32.77,46.23 v33.02,46.74 | v24.89,44.45 24.13,45.21 24.13,45.72 23.88,45.97 R18.1
N$19
  Bottom 0.406: IC3.2 41.15,46.38 41.15,47.24 40.64,47.75 37.59,47.75 36.58,48.77 R19.1
N$20
  Bottom 0.406: IC3.3 42.42,46.38 42.42,47.5 41.4,48.51 39.88,48.51 39.12,49.28 R20.1
N$21
  Bottom 0.406: IC3.4 43.69,46.38 43.69,47.75 41.66,49.78 R21.1
N$22
  Bottom 0.406: IC3.5 44.96,46.38 44.96,48.26 44.2,49.02 R22.1
N$23
  Bottom 0.406: IC3.6 46.48,46.38 46.48,48.51 46.74,48.77 R23.1
N$24
  Bottom 0.406: IC3.7 47.75,46.38 47.75,48.26 49.28,49.78 R24.1
N$25
  Bottom 0.406: U$1.7 33.81,28.48 Q1.2 36.72,31.38 C8.2
N$26
  Bottom 0.406: U$1.8 37.23,27.68 C9.2 38.72,25.4 Q1.1
N$27  (via drill 0.6)
  Top 0.406: v51.56,11.68 49.78,11.68 48.77,12.7 44.2,12.7 42.93,11.43 v27.94,11.43
  Bottom 0.406: U$1.12 27.18,26.08 27.18,20.07 26.92,19.81 26.92,16.76 27.94,15.75 v27.94,11.43 | v51.56,11.68 51.94,12.06 S1.2 S1.1
R1
  Bottom 0.406: JP1.1 R8.2
R2
  Bottom 0.406: R23.2 JP2.15
R3
  Bottom 0.406: JP1.4 R5.2
R4
  Bottom 0.406: R20.2 JP2.12
R5
  Bottom 0.406: JP1.11 R2.2
R6
  Bottom 0.406: R17.2 JP2.5
R7
  Bottom 0.406: JP1.14 R10.2
R8
  Bottom 0.406: R14.2 JP2.2
RESET  (via drill 0.6)
  Top 0.406: v27.43,51.31 27.69,51.05 55.12,51.05 55.37,50.8 J1.5
  Bottom 0.406: U$1.29 27.18,34.88 27.18,35.81 26.92,36.07 26.92,50.29 27.43,50.8 v27.43,51.31 | R25.1 57.04,52.07 57.15,52.07 J1.5
ROW1  (via drill 0.6)
  Top 0.406: v49.53,26.92 49.53,29.46 49.78,29.72 50.29,29.72 52.83,32.26 52.83,42.93 49.53,46.23 38.86,46.23 38.61,46.48 34.54,46.48 34.29,46.74 v34.54,46.99
  Bottom 0.406: v34.54,46.99 34.04,47.24 JP2.10 | ULN2803.11 53.85,19.36 53.85,21.84 49.53,26.16 v49.53,26.92
ROW2  (via drill 0.6)
  Top 0.406: v47.5,26.92 46.48,27.94 46.48,30.23 46.99,30.73 50.04,30.73 52.07,32.77 52.07,42.42 49.02,45.47 38.35,45.47 38.1,45.72 33.27,45.72 32.26,44.7 v31.5,44.7
  Bottom 0.406: v31.5,44.7 JP2.9 | ULN2803.12 52.58,19.36 52.58,21.08 47.5,26.16 v47.5,26.92
ROW3  (via drill 0.6)
  Top 0.406: v27.94,43.94 28.19,43.94 28.45,43.69 32.51,43.69 33.78,44.96 37.59,44.96 37.85,44.7 48.51,44.7 51.31,41.91 51.31,33.02 49.78,31.5 46.48,31.5 45.72,30.73 v45.72,26.67
  Bottom 0.406: JP2.8 28.96,45.72 27.94,44.7 v27.94,43.94 | ULN2803.13 51.31,19.36 51.31,20.57 45.72,26.16 v45.72,26.67
ROW4  (via drill 0.6)
  Top 0.406: v25.91,43.43 26.67,43.43 27.18,42.93 33.02,42.93 34.29,44.2 37.08,44.2 37.34,43.94 48.01,43.94 49.78,42.16 50.04,42.16 50.55,41.66 50.55,33.53 49.28,32.26 45.21,32.26 44.45,31.5 44.45,26.16 45.72,24.89 v45.72,24.38
  Bottom 0.406: v25.91,43.43 25.91,52.32 26.42,52.83 JP2.7 | v45.72,24.38 48.51,21.59 48.77,21.59 50.16,20.19 ULN2803.14
ROW5  (via drill 0.6)
  Top 0.406: JP1.10 34.04,8.64 34.54,9.14 v50.8,9.14
  Bottom 0.406: v50.8,9.14 50.55,9.4 50.55,16.76 48.9,18.41 ULN2803.15
ROW6  (via drill 0.6)
  Top 0.406: JP1.9 31.5,8.64 32.77,9.91 46.99,9.91 48.01,10.92 v48.01,11.68
  Bottom 0.406: v48.01,11.68 48.01,17.53 47.62,17.91 ULN2803.16
ROW7  (via drill 0.6)
  Top 0.406: JP1.8 28.96,8.38 31.24,10.67 44.7,10.67 45.47,11.43 v45.47,11.68
  Bottom 0.406: v45.47,11.68 45.47,16.76 46.35,17.65 ULN2803.17
ROW8
  Bottom 0.406: ULN2803.18 40.97,19.23 39.12,21.08 37.85,21.08 37.34,20.57 37.34,20.32 36.83,19.81 34.29,19.81 30.48,16 30.48,11.3 JP1.7
ROW_1  (via drill 0.6)
  Top 0.406: v49.53,34.8 49.53,36.07 47.24,38.35 42.42,38.35 41.66,37.59 38.35,37.59 37.08,36.32 33.02,36.32 32,37.34 29.72,37.34 29.46,37.08 v27.94,37.08
  Bottom 0.406: v27.94,37.08 27.87,37.01 U$1.30 | ULN2803.8 53.85,29.16 53.85,30.23 49.53,34.54 v49.53,34.8
ROW_2  (via drill 0.6)
  Top 0.406: v30.99,36.32 31.75,36.32 32.51,35.56 37.59,35.56 38.86,36.83 42.16,36.83 42.93,37.59 46.48,37.59 48.51,35.56 48.51,34.04 48.77,33.78 v48.77,33.53
  Bottom 0.406: v30.99,36.32 28.96,36.32 28.67,36.04 U$1.31 | v48.77,33.53 50.55,31.75 51.05,31.75 52.7,30.1 ULN2803.7
ROW_3  (via drill 0.6)
  Top 0.406: v47.5,34.8 46.99,35.31 46.99,35.81 45.97,36.83 43.43,36.83 42.67,36.07 39.12,36.07 37.85,34.8 v30.99,34.8
  Bottom 0.406: v30.99,34.8 30.96,34.77 U$1.32 | ULN2803.6 51.31,29.16 51.31,30.23 50.55,30.99 50.29,30.99 49.02,32.26 48.51,32.26 47.5,33.27 v47.5,34.8
ROW_4  (via drill 0.6)
  Top 0.406: v32.51,33.78 32.77,34.04 38.1,34.04 39.37,35.31 42.93,35.31 43.69,36.07 45.72,36.07 46.23,35.56 v46.23,33.53
  Bottom 0.406: U$1.1 31.46,33.78 v32.51,33.78 | ULN2803.5 50.04,29.16 50.04,30.23 49.78,30.48 49.53,30.48 48.51,31.5 48.26,31.5 v46.23,33.53
ROW_5  (via drill 0.6)
  Top 0.406: v33.53,32.51 34.29,33.27 38.61,33.27 39.88,34.54 44.2,34.54 v44.7,35.05
  Bottom 0.406: U$1.2 31,32.51 v33.53,32.51 | ULN2803.4 48.77,29.16 48.77,30.23 48.26,30.73 48.01,30.73 46.48,32.26 45.47,32.26 44.7,33.02 v44.7,35.05
ROW_6  (via drill 0.6)
  Top 0.406: v29.72,17.27 29.97,17.53 40.89,17.53 42.42,19.05 42.42,30.48 43.69,31.75 v43.69,33.53
  Bottom 0.406: U$1.9 29.46,20.83 29.97,20.32 29.97,18.03 29.72,17.78 v29.72,17.27 | ULN2803.3 47.5,29.16 47.5,30.23 46.23,31.5 44.2,31.5 43.69,32 v43.69,33.53
ROW_7  (via drill 0.6)
  Top 0.406: v27.94,17.53 28.7,17.78 29.21,18.29 40.13,18.29 41.4,19.56 41.4,31.5 42.16,32.26 v42.16,33.53
  Bottom 0.406: U$1.10 28.7,26.16 28.7,20.32 29.21,19.81 29.21,18.54 28.45,17.78 v27.94,17.53 | ULN2803.2 46.23,29.16 46.23,29.97 45.47,30.73 42.93,30.73 42.16,31.5 v42.16,33.53
ROW_8  (via drill 0.6)
  Top 0.406: v27.94,19.05 39.37,19.05 40.64,20.32 v40.64,33.53
  Bottom 0.406: U$1.11 27.94,26.12 v27.94,19.05 | ULN2803.1 44.4,29.72 41.91,29.72 40.64,30.99 v40.64,33.53
SR_CLEAR  (via drill 0.6)
  Top 0.406: v47.5,42.16 46.48,43.18 36.83,43.18 36.58,43.43 34.54,43.43 33.27,42.16 26.67,42.16 26.42,42.42 24.64,42.42 v24.13,42.93 18.29,42.93 v17.27,41.91
  Bottom 0.406: IC1.10 16,22.25 16,35.81 17.14,36.96 IC2.10 17.27,40.23 v17.27,41.91 | IC3.10 47.5,40.23 v47.5,42.16 | v24.13,42.93 24.13,40.39 24.89,39.62 24.89,38.35 24.67,38.13 U$1.26
SR_CLK  (via drill 0.6)
  Top 0.406: v14.99,32.51 v17.27,32.51 v20.83,32.51 | v33.78,37.34 32.77,38.35 25.4,38.35 25.15,38.1 v15.88,38.1
  Bottom 0.406: IC1.11 17.27,22.25 v17.27,32.51 | v14.99,32.51 14.99,36.07 15.88,36.96 v15.88,38.1 IC2.11 | U$1.23 22.34,32.51 v20.83,32.51 | IC3.11 46.23,39.98 46.23,37.85 44.7,36.32 38.1,36.32 37.85,36.07 34.8,36.07 33.78,37.08 v33.78,37.34
SR_DATA
  Bottom 0.406: IC1.14 20.83,22.25 20.83,24.13 19.81,25.15 19.81,33.53 20.57,34.04 22.1,34.04 22.38,33.76 U$1.24
SR_DATA2
  Bottom 0.406: IC1.9 14.73,22.25 14.73,30.73 11.94,33.53 11.94,38.86 12.06,38.99 IC2.14
SR_DATA3  (via drill 0.6)
  Top 0.406: v38.1,38.86 36.32,40.64 25.4,40.64 25.15,40.89 v21.34,40.89
  Bottom 0.406: IC3.14 42.42,39.98 42.42,38.86 42.16,38.61 38.61,38.61 38.35,38.86 v38.1,38.86 | v21.34,40.89 21.08,41.15 19.05,41.15 18.41,40.51 IC2.9
SR_EN  (via drill 0.6)
  Top 0.406: v12.95,36.83 18.29,36.83 v18.54,36.58 19.81,36.58 20.57,37.34 v25.91,37.34 | v36.83,37.85 34.8,39.88 24.89,39.88 24.64,40.13 22.86,40.13 22.61,39.88 v19.81,39.88
  Bottom 0.406: IC1.13 19.56,22.25 19.56,24.13 19.05,24.64 19.05,33.78 18.54,34.54 v18.54,36.58 18.54,36.83 19.81,38.1 v19.81,39.88 | v12.95,36.83 13.34,37.21 IC2.13 | IC3.13 43.94,39.98 43.94,38.61 43.18,37.85 v36.83,37.85 | U$1.27 25.4,34.84 25.4,37.08 25.65,37.34 v25.91,37.34
SR_LATCH  (via drill 0.6)
  Top 0.406: v13.97,35.31 v17.27,35.31 v22.61,35.31 | v35.31,37.59 33.78,39.12 v23.88,39.12
  Bottom 0.406: IC1.12 18.29,22.25 18.29,23.88 18.03,24.13 18.03,31.5 18.29,32 18.29,33.02 17.27,34.29 v17.27,35.31 | v13.97,35.31 13.97,36.32 14.61,36.96 IC2.12 | IC3.12 45.21,39.98 45.21,38.1 44.2,37.08 37.85,37.08 37.59,36.83 36.07,36.83 v35.31,37.59 | v23.88,39.12 v23.87,39.11 U$1.25 23.34,35.31 v22.61,35.31
VCC  (via drill 0.6)
  Top 0.406: JP3.6 C2.1 43.94,1.27 48.26,1.27 57.15,10.16 C3.1 50.55,20.83 v43.43,20.83 | v53.59,46.99 v53.59,49.78 53.59,50.29 22.1,50.29 v9.65,37.85 JP6.1 3.17,37.97 3.17,42.55 C10.1 2.29,43.18 1.78,43.69 1.78,48.77 3.81,50.8 3.81,53.34 3.3,53.85 1.27,53.85 v1.02,54.1 | v5.08,9.14 3.3,7.62 v2.54,7.62 | J2.GND 5.16,16.94 J2.GNDBREAK 10.8,19.94 12.19,21.34 25.65,21.34 v25.91,21.08 26.16,20.83 28.96,20.83 29.21,20.57 35.56,20.57 v36.07,21.08
  Bottom 0.406: IC2.16 9.65,39.98 v9.65,37.85 C7.1 | 27.43,29.97 22.48,29.97 U$1.20 22.27,29.97 21.34,29.97 20.57,29.21 20.57,28.7 | 20.57,28.7 20.8,28.48 U$1.18 | 20.57,28.7 20.83,28.45 20.83,25.65 23.5,22.99 IC1.16 | IC1.16 25.4,20.22 C4.1 | IC1.16 24.54,21.08 v25.91,21.08 | JP5.1 51.05,57.15 53.59,54.61 53.59,52.83 | v53.59,49.78 53.59,52.83 | v53.59,46.99 53.85,46.74 53.85,43.69 | 53.85,43.69 53.85,39.37 55.37,37.85 JP4.6 | R25.2 54.98,52.83 53.59,52.83 | J1.2 58.42,44.2 57.91,43.69 53.85,43.69 | IC3.16 38.49,40.11 C1.1 34.15,40.24 32.51,38.61 32.51,36.07 35.31,33.27 35.31,32.51 34.04,31.24 34.04,30.23 33.02,29.21 33.02,29.58 C6.1 32.22,29.28 U$1.6 29.79,29.28 29.21,28.7 28.45,28.7 27.69,29.46 27.69,29.72 27.43,29.97 | v2.54,7.62 1.27,8.89 1.27,9.14 1.02,9.4 v1.02,54.1 | J2.GND 5.08,15.16 v5.08,9.14 | 27.43,29.97 27.69,30.23 27.69,30.73 28.19,31.24 28.96,31.24 29.21,30.99 30.23,30.99 30.33,30.88 U$1.4 | v36.07,21.08 36.83,21.84 39.37,21.84 41.15,20.07 43.18,20.07 43.43,20.32 v43.43,20.83 | C5.1 56.28,22.49 55.37,21.59 55.37,19.36 ULN2803.10 55.5,18.97 55.5,15.88 C3.1

### Text on the board
tPlace: 32 | Matrix Board v1 | Evan Green 10/2010 | 1
bPlace: GND | 1 | AVR | VCC | VCC | CS | CS | MOSI | MOSI | MISO | MISO | CLK | CLK | GND | GND | Matrix Board v1 | Evan Green 10/2010 | +5V | GND